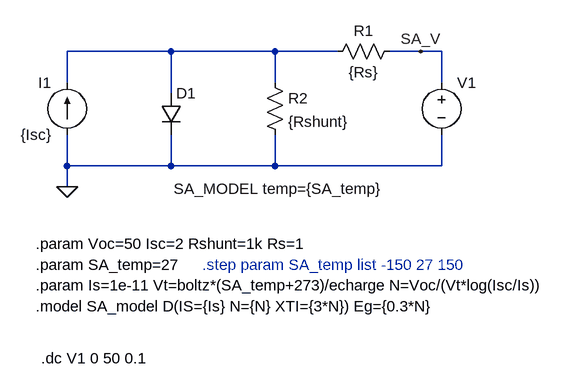
[diagram p0: schematic solar array model.asc]
solar array model.asc, the LTspice schematic file:
Version 4
SHEET 1 1444 960
WIRE 336 96 176 96
WIRE 496 96 336 96
WIRE 592 96 496 96
WIRE 720 96 672 96
WIRE 752 96 720 96
WIRE 176 144 176 96
WIRE 496 144 496 96
WIRE 752 144 752 96
WIRE 336 160 336 96
WIRE 176 272 176 224
WIRE 336 272 336 224
WIRE 336 272 176 272
WIRE 496 272 496 224
WIRE 496 272 336 272
WIRE 752 272 752 224
WIRE 752 272 496 272
WIRE 176 304 176 272
FLAG 176 304 0
FLAG 720 96 SA_V
SYMBOL current 176 224 R180
WINDOW 0 24 80 Left 2
WINDOW 3 24 0 Left 2
SYMATTR InstName I1
SYMATTR Value {Isc}
SYMBOL diode 320 160 R0
WINDOW 3 20 147 Left 2
SYMATTR Value SA_MODEL temp={SA_temp}
SYMATTR InstName D1
SYMBOL res 688 80 R90
WINDOW 0 0 56 VBottom 2
WINDOW 3 32 56 VTop 2
SYMATTR InstName R1
SYMATTR Value {Rs}
SYMBOL res 480 128 R0
SYMATTR InstName R2
SYMATTR Value {Rshunt}
SYMBOL voltage 752 128 R0
WINDOW 123 0 0 Left 0
WINDOW 39 0 0 Left 0
SYMATTR InstName V1
SYMATTR Value ""
TEXT 128 488 Left 2 !.model SA_model D(IS={Is} N={N} XTI={3*N}) Eg={0.3*N}
TEXT 128 392 Left 2 !.param Voc=50 Isc=2 Rshunt=1k Rs=1
TEXT 136 568 Left 2 !.dc V1 0 50 0.1
TEXT 384 424 Left 2 ;.step param SA_temp list -150 27 150
TEXT 128 424 Left 2 !.param SA_temp=27
TEXT 128 456 Left 2 !.param Is=1e-11 Vt=boltz*(SA_temp+273)/echarge N=Voc/(Vt*log(Isc/Is))

The netlist it stands for:
* solar array model.asc
I1 0 N001 {Isc}
D1 N001 0 SA_MODEL temp={SA_temp}
R1 SA_V N001 {Rs}
R2 N001 0 {Rshunt}
V1 SA_V 0
.model D D
.lib standard.dio
.model SA_model D(IS={Is} N={N} XTI={3*N}) Eg={0.3*N}
.param Voc=50 Isc=2 Rshunt=1k Rs=1
.dc V1 0 50 0.1
* .step param SA_temp list -150 27 150
.param SA_temp=27
.param Is=1e-11 Vt=boltz*(SA_temp+273)/echarge N=Voc/(Vt*log(Isc/Is))
.backanno
.end